# Altium schematic sheet FETs.SchDoc: FET System
size A4; ApprovedBy: Self; CheckedBy: Self; CompanyName: TAISAT; DrawnBy: Alperen FENERCİ; Organization: IKA; SheetNumber: 3; SheetTotal: 6
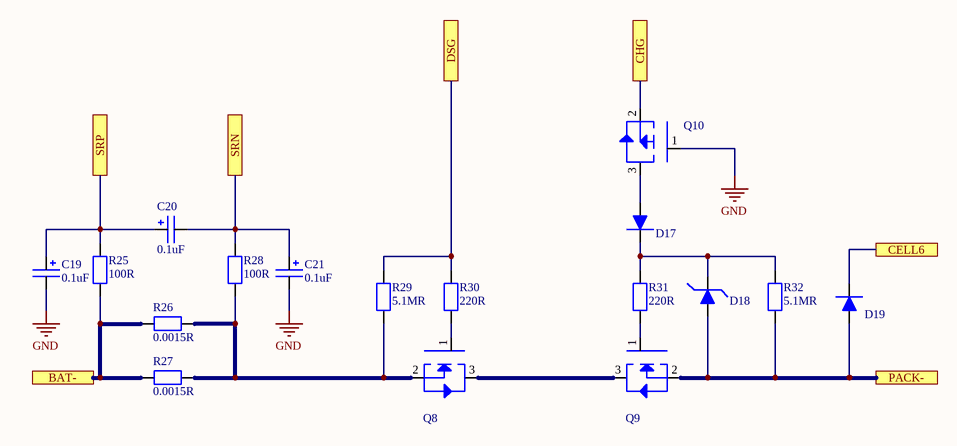
[diagram p0: FETs.SchDoc]

## Parts
C19  value 0.1uF  [CAP 0603]  (hidden comment: CAP 0603)
C20  value 0.1uF  [CAP 0603]  (hidden comment: CAP 0603)
C21  value 0.1uF  [CAP 0603]  (hidden comment: CAP 0603)
D17  1N4007W  [SOD123]  (value not drawn)
D18  MMSZ36V-HT  [SOD123]  (value not drawn)
D19  US1D_R1  [DO214AC]  (value not drawn)
Q8  IRF2804STRL  [D2PAK-7]  (value not drawn)
Q9  IRF2804STRL  [D2PAK-7]  (value not drawn)
Q10  PJA3441  [SOT23-3]  (value not drawn)
R25  value 100R  [RESISTOR 0603]  (hidden comment: RES 0603)
R26  value 0.0015R  [RESISTOR 2512]  (hidden comment: RES 2512)
R27  value 0.0015R  [RESISTOR 2512]  (hidden comment: RES 2512)
R28  value 100R  [RESISTOR 0603]  (hidden comment: RES 0603)
R29  value 5.1MR  [RESISTOR 0603]  (hidden comment: RES 0603)
R30  value 220R  [RESISTOR 0603]  (hidden comment: RES 0603)
R31  value 220R  [RESISTOR 0603]  (hidden comment: RES 0603)
R32  value 5.1MR  [RESISTOR 0603]  (hidden comment: RES 0603)

## Ports
BAT-, CELL6, CHG, DSG, PACK-, SRN, SRP

## Nets
GND: C19.2 C21.2 Q10.1(G)
BAT-: R25.1 R26.1 R27.1 ; port BAT-
CELL6: D19.1 ; port CELL6
CHG: Q10.2(S) ; port CHG
DSG: R29.2 R30.2 ; port DSG
PACK-: D18.2 D19.2 Q9.2(S) R32.1 ; port PACK-
SRN: C20.2 C21.1 R28.2 ; port SRN
SRP: C19.1 C20.1 R25.2 ; port SRP
NetD17_1: D17.1 D18.1 R31.2 R32.2
NetD17_2: D17.2 Q10.3(D)
NetQ8_1: Q8.1(G) R30.1
NetQ8_2: Q8.2(S) R26.2 R27.2 R28.1 R29.1
NetQ8_3: Q8.3(D) Q9.3(D)
NetQ9_1: Q9.1(G) R31.1

## Notes on the sheet
- Dosya Adı / File Name
- Proje Adı / Project Name
- Sayfa Adı / Sheet Name
- Şirket Adı / Company Name
- Tasarlayan / Designed By
- Takım / Team
- Kontrol Eden / Checked By
- Başlangıç Tarihi / Start Date
- Revize Tarihi / Revision Date
- Onaylayan / Approved By
- Sayfa / Sheet

## Library data of the parts
C19-C21 = CAP 0603: Multilayer Ceramic Capacitor; Capacitor Type: MLCC; Case/Package: 0603
D17 = 1N4007W: Diode Gen; Voltage: 1000V; Diode Type: General; Case/Package: DO-41-2
D18 = MMSZ36V-HT: Diode Zener; Voltage: 36V; Case/Package: SOD123; Diode Type: Zener
D19 = US1D_R1: Diode Gen; Voltage: 200V; Diode Type: General; Case/Package: DO-214AC
Q8 Q9 = IRF2804STRL: MOSFET; Voltage: 40V; Current: 160A; Transistor Type: N-CH; Case/Package: TO263-7
Q10 = PJA3441: MOSFET; Transistor Type: P-CH; Voltage: 40V; Current: 3.1A; Case/Package: SOT23
R25 R28-R32 = RES 0603: SMD Chip Resistor; Case/Package: 0603
R26 R27 = RES 2512: SMD Chip Resistor; Case/Package: 1206